# EAGLE design hal9kpost (EAGLE 7.2.0)
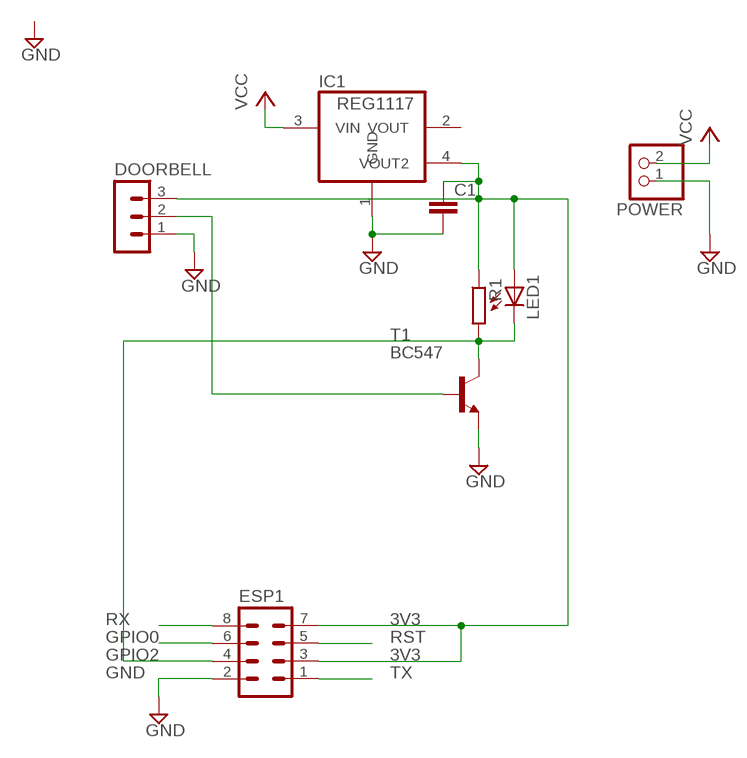
[diagram p0: schematic, sheet 1]

## Parts
C1  C-EUC0805K  [C0805K]
DOORBELL  MA03-1  [MA03-1]
ESP1  MA04-2  [MA04-2]
IC1  REG1117  [SOT223]
LED1  LED5MM  [LED5MM]
POWER  PINHD-1X2  [1X02]
R1  R-EU_0207/10  [0207/10]
T1  BC547  [TO92]

## Nets
3V3: C1.1 DOORBELL.3 ESP1.3 ESP1.7 IC1.4(VOUT2) LED1.A R1.1
GND: C1.2 DOORBELL.1 ESP1.2 IC1.1(GND) POWER.1 T1.1(E)
GPIO0: ESP1.6
GPIO2: ESP1.4 LED1.K(C) R1.2 T1.3(C)
N$3: DOORBELL.2 T1.2(B)
RST: ESP1.5
RX: ESP1.8
TX: ESP1.1
VCC: IC1.3(VIN) POWER.2
Unconnected: IC1.2(VOUT)

## Library data of the parts
C1 = rcl:C-EU: CAPACITOR, European symbol
DOORBELL = con-lstb:MA03-1: PIN HEADER; OC_FARNELL: unknown; OC_NEWARK: unknown
ESP1 = con-lstb:MA04-2: PIN HEADER; OC_FARNELL: unknown; OC_NEWARK: unknown
IC1 = burr-brown:REG1117: 800mA and 1A Low Dropout (LDO) Positive Regulator 1.8V, 2.5V, 2.85V, 3.3V, 5V, and Adj; MPN: REG1117; OC_FARNELL: 1097566; OC_NEWARK: 14P6981
LED1 = adafruit:LED: LED OSRAM: - CHIPLED LG R971, LG N971, LY N971, LG Q971, LY Q971, LO R971, LY R971 LH N974, LH R974 LS Q976, LO Q976, LY Q976 LO Q996 - Hyper CHIPLED LW Q18S LB Q993, LB Q99A, LB R99A - SideLED LS A670, LO A670, LY A670, LG A670, LP A670 LB A673, LV A673, LT A673, LW A673 LH A674 LY A675 LS A676, LA A676, LO A676, LY A676, LW A676 LS A679, LY A679, LG A679 - Hyper Micro SIDELED® LS Y876, LA Y876, LO Y876, LY Y876 LT Y87S - SmartLED LW L88C, LW L88S LB L89C, LB L89S, LG L890 LS L89K, LO L89K, LY L89K LS L896, LA L896, LO L896, LY L896 - TOPLED LS T670, LO T670, LY T670, LG T670, LP T670 LSG T670, LSP T670, LSY T670, LOP T670, LYG T670 LG T671, LOG T671, LSG T671 LB T673, LV T673, LT T673, LW T673 LH T674 LS T676, LA T676, LO T676, LY T676, LB T676, LH T676, LSB T676, LW T676 LB T67C, LV T67C, LT T67C, LS T67K, LO T67K, LY T67K, LW E67C LS E67B, LA E67B, LO E67B, LY E67B, LB E67C, LV E67C, LT E67C LW T67C LS T679, LY T679, LG T679 LS T770, LO T770, LY T770, LG T770, LP T770 LB T773, LV T773, LT T773, LW T773 LH T774 LS E675, LA E675, LY E675, LS T675 LS T776, LA T776, LO T776, LY T776, LB T776 LHGB T686 LT T68C, LB T68C - Hyper Mini TOPLED® LB M676 - Mini TOPLED Santana® LG M470 LS M47K, LO M47K, LY M47K Source: http://www.osram.convergy.de/
POWER = pinhead:PINHD-1X2: PIN HEADER
R1 = rcl:R-EU_: RESISTOR, European symbol
T1 = transistor:BC547: NPN TRANSISTOR

## Board
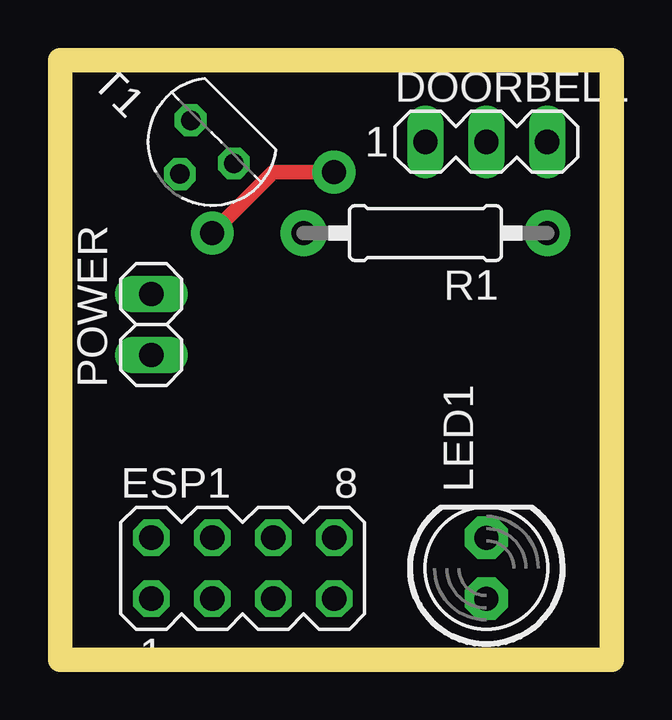
[diagram p1: board, top side]
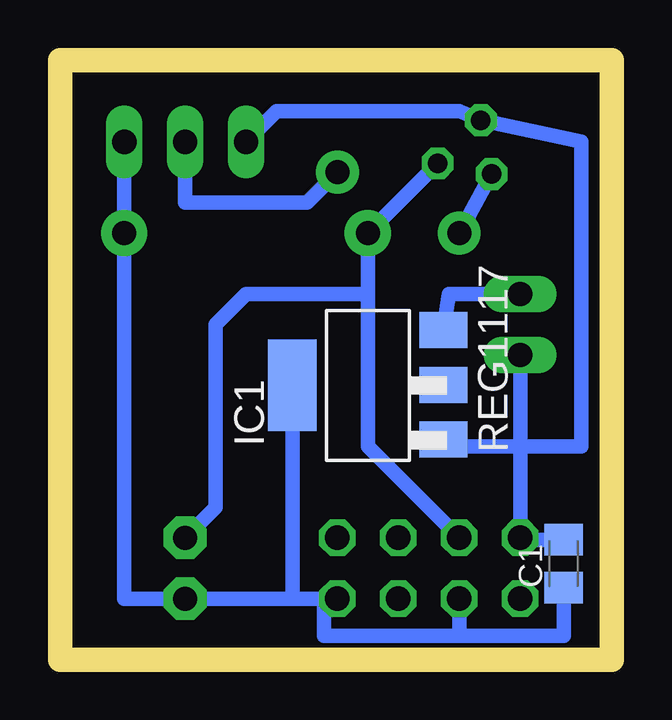
[diagram p2: board, bottom side, seen from below]

Size 23 x 25 mm. Coordinates in mm from the lower left corner, seen from the top.
Outline: 0,0 23,0 23,25 0,25 0,0
Copper layers (1*16): Top 0.035mm / dielectric 1.5mm / Bottom 0.035mm
Design rules "default *": minimum track width 24mil, minimum drill 24mil, track to track 24mil, track to pad 24mil, pad to pad 24mil, via to via 24mil, smd to smd 8mil, copper to edge 40mil, drill to drill 8mil, minimum pad ring 10mil, minimum via ring 8mil, stop-mask expansion 4mil, vias tented up to drill 0mil, thermal gap 10mil
Milling: 4 lines

### Footprints (pad centres in the part's own frame; a part is rotated, then mirrored left to right if it is on the bottom)
C0805K = smd 1.3 x 1.6: 1 -1,0; 2 1,0
MA03-1 = drill 1.016 long: 1 -2.54,0; 2 0,0; 3 2.54,0
MA04-2 = drill 1.016 octagon: 1 -3.81,-1.27; 2 -3.81,1.27; 3 -1.27,-1.27; 4 -1.27,1.27; 5 1.27,-1.27; 6 1.27,1.27; 7 3.81,-1.27; 8 3.81,1.27
SOT223 = smd 1.499 x 2.007: 1 -2.261,-3.15; 2 0.025,-3.15; 3 2.311,-3.15 | smd 3.81 x 2.007: 4 0,3.15
LED5MM = drill 1 pad 1.778 octagon: A -1.27,0; K 1.27,0
1X02 = drill 1.016 long: 1 -1.27,0; 2 1.27,0
0207/10 = drill 1 pad 1.93: 1 -5.08,0; 2 5.08,0
TO92 = drill 0.813 octagon: 1 1.27,0; 2 0,1.905; 3 -1.27,0

### Placement (x,y rotation side)
C1  2,4 90 bottom
DOORBELL  17.78,21.59 0 top
ESP1  7.62,3.81 0 top
IC1  10.16,11.43 90 bottom
LED1  17.78,3.81 90 top
POWER  3.81,13.97 90 top
R1  15.24,17.78 180 top
T1  6.35,21.59 135 top

### Tracks (layer width: path | path; a pad name or v marks a point on that pad's centre or on a via)
3V3
  Bottom 0.61: DOORBELL.3 R1.1 20.32,2.54 LED1.A ESP1.7 | ESP1.7 13.31,2.54 IC1.4 | ESP1.7 12,2.54 12,1 6.35,1 | 6.35,1 ESP1.3 | 6.35,1 2,1 C1.1
GND
  Bottom 0.61: 3.81,8.89 ESP1.2 3.81,5 C1.2 | 3.81,8.89 6.73,8.89 IC1.1 | DOORBELL.1 13.97,22.86 6.35,22.86 T1.1 1.27,21.59 1.27,8.89 3.81,8.89 | POWER.1 3.81,8.89
GPIO2
  Bottom 0.61: 10.16,15.24 10.16,8.89 ESP1.4 | LED1.K 16.51,6.35 16.51,13.97 15.24,15.24 10.16,15.24 | 10.16,15.24 R1.2 T1.3
N$3  (via drill 1 pad 1.78)
  Top 0.61: v6.35,17.78 8.89,20.32 v11.43,20.32
  Bottom 0.61: T1.2 v6.35,17.78 | DOORBELL.2 17.78,19.05 12.7,19.05 v11.43,20.32
VCC
  Bottom 0.61: POWER.2 6.78,15.24 IC1.3